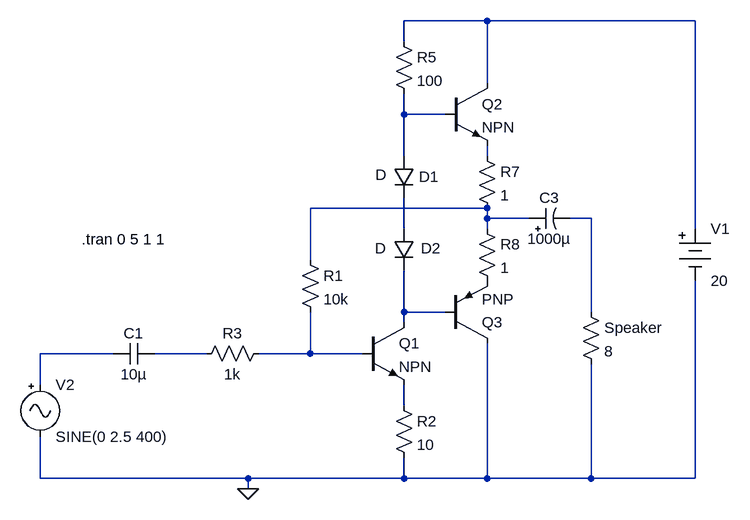
[diagram p0: schematic poweramp - original.asc]
poweramp - original.asc, the LTspice schematic file:
Version 4
SHEET 1 880 680
WIRE -16 -240 -144 -240
WIRE 304 -240 -16 -240
WIRE -144 -208 -144 -240
WIRE -16 -144 -16 -240
WIRE -144 -96 -144 -128
WIRE -80 -96 -144 -96
WIRE -144 -32 -144 -96
WIRE -16 -32 -16 -48
WIRE -16 48 -288 48
WIRE -16 64 -16 48
WIRE 48 64 -16 64
WIRE 144 64 112 64
WIRE -144 80 -144 32
WIRE -16 80 -16 64
WIRE 304 80 304 -240
WIRE -288 128 -288 48
WIRE -144 208 -144 144
WIRE -80 208 -144 208
WIRE 144 208 144 64
WIRE -144 224 -144 208
WIRE -592 272 -704 272
WIRE -448 272 -528 272
WIRE -288 272 -288 208
WIRE -288 272 -368 272
WIRE -208 272 -288 272
WIRE -704 320 -704 272
WIRE -144 352 -144 320
WIRE -704 464 -704 400
WIRE -384 464 -704 464
WIRE -144 464 -144 432
WIRE -144 464 -384 464
WIRE -16 464 -16 256
WIRE -16 464 -144 464
WIRE 144 464 144 288
WIRE 144 464 -16 464
WIRE 304 464 304 160
WIRE 304 464 144 464
WIRE -384 480 -384 464
FLAG -384 480 0
SYMBOL npn3 -208 224 R0
SYMATTR InstName Q1
SYMBOL res -304 112 R0
SYMATTR InstName R1
SYMATTR Value 10k
SYMBOL Misc\\signal -704 304 R0
WINDOW 123 0 0 Left 0
WINDOW 39 0 0 Left 0
SYMATTR InstName V2
SYMATTR Value SINE(0 2.5 400)
SYMBOL res -160 -224 R0
SYMATTR InstName R5
SYMATTR Value 100
SYMBOL npn -80 -144 R0
SYMATTR InstName Q2
SYMBOL Misc\\battery 304 64 R0
WINDOW 123 0 0 Left 0
WINDOW 39 0 0 Left 0
SYMATTR InstName V1
SYMATTR Value 20
SYMBOL res 128 192 R0
SYMATTR InstName Speaker
SYMATTR Value 8
SYMBOL pnp -80 256 M180
SYMATTR InstName Q3
SYMBOL diode -160 -32 R0
WINDOW 0 39 32 Left 0
WINDOW 3 -28 29 Left 0
SYMATTR InstName D1
SYMBOL diode -160 80 R0
WINDOW 0 42 30 Left 0
WINDOW 3 -29 30 Left 0
SYMATTR InstName D2
SYMBOL res -32 -48 R0
SYMATTR InstName R7
SYMATTR Value 1
SYMBOL res -32 64 R0
SYMATTR InstName R8
SYMATTR Value 1
SYMBOL Misc\\EuropeanPolcap 48 80 R270
WINDOW 0 32 32 VTop 0
WINDOW 3 0 32 VBottom 0
SYMATTR InstName C3
SYMATTR Value 1000µ
SYMBOL cap -528 256 R90
WINDOW 0 0 32 VBottom 0
WINDOW 3 32 32 VTop 0
SYMATTR InstName C1
SYMATTR Value 10µ
SYMBOL res -160 336 R0
SYMATTR InstName R2
SYMATTR Value 10
SYMBOL res -352 256 R90
WINDOW 0 0 56 VBottom 0
WINDOW 3 32 56 VTop 0
SYMATTR InstName R3
SYMATTR Value 1k
TEXT -640 96 Left 0 !.tran 0 5 1 1

The netlist it stands for:
* poweramp - original.asc
Q1 N007 N010 N011 0 NPN
R1 N004 N010 10k
V2 N008 0 SINE(0 2.5 400)
R5 N001 N002 100
Q2 N001 N002 N003 0 NPN
V1 N001 0 20
R§Speaker N005 0 8
Q3 0 N007 P001 0 PNP
D1 N002 N006 D
D2 N006 N007 D
R7 N003 N004 1
R8 N004 P001 1
C3 N004 N005 1000µ
C1 N009 N008 10µ
R2 N011 0 10
R3 N010 N009 1k
.model D D
.lib standard.dio
.model NPN NPN
.model PNP PNP
.lib standard.bjt
.tran 0 5 1 1
.backanno
.end